# Altium project Master_HV_PCB.PrjPcb (part 1 of 2)
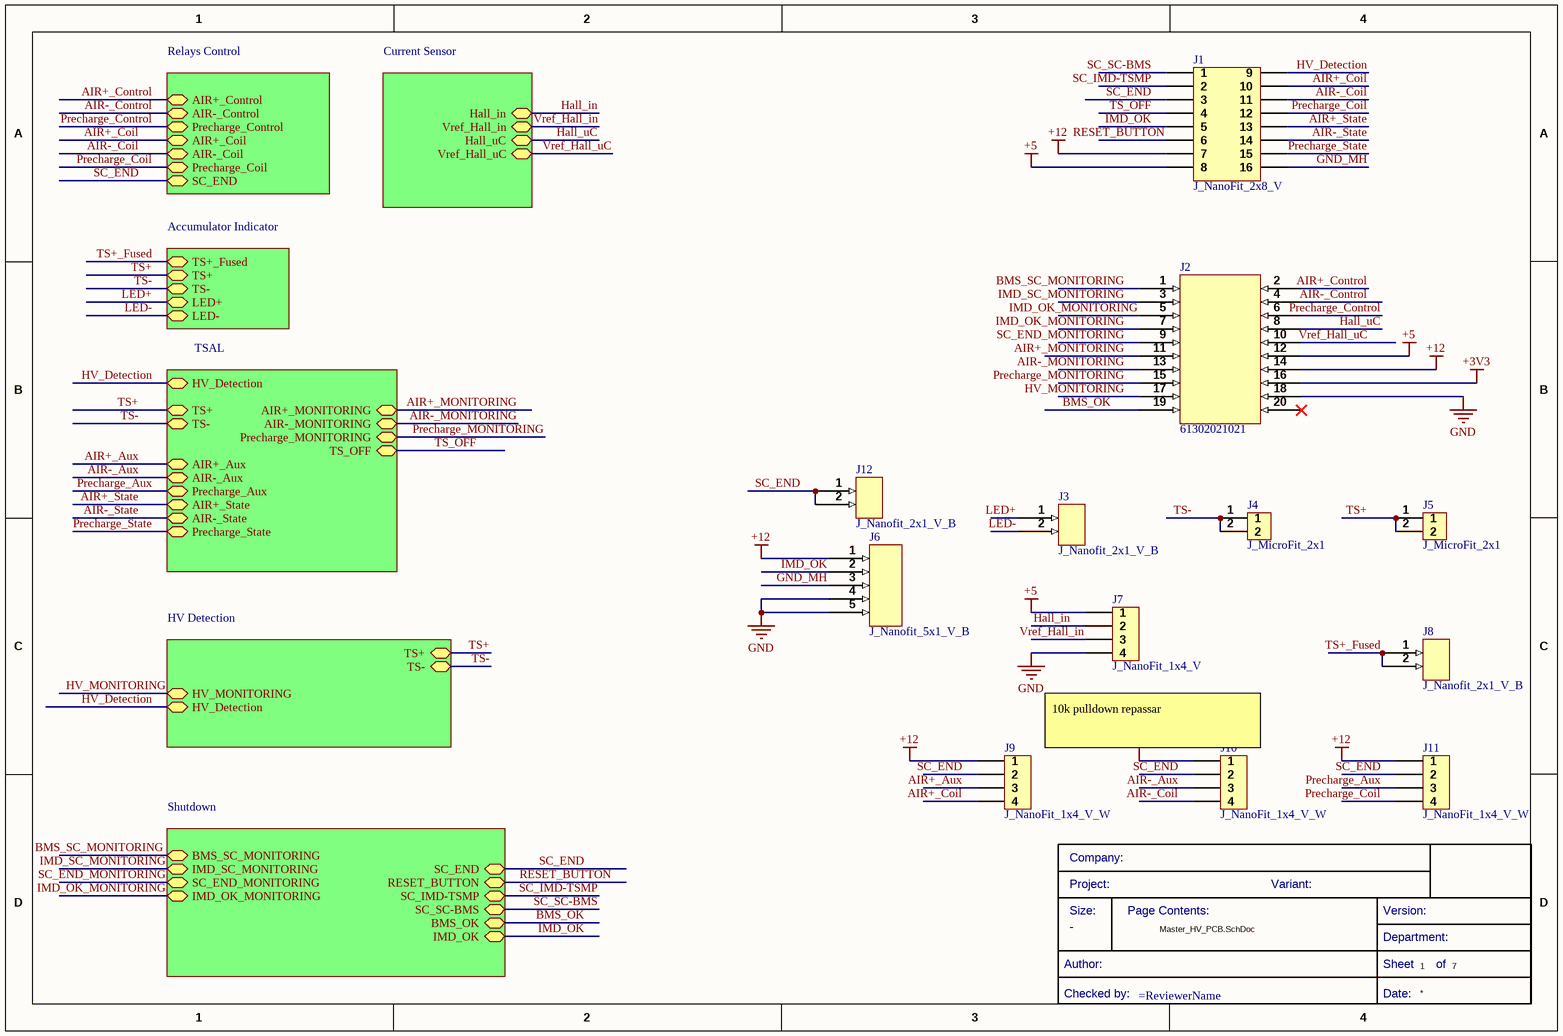
[diagram p0: Master_HV_PCB.SchDoc]
7 sheets, 114 parts. Net scope: hierarchical (ports join the sheet entries above them; power ports are global).
Sheets:
  Master_HV_PCB.SchDoc
    Relays Control = [4]Relays_Control.SchDoc
    Accumulator Indicator = [6]Accumulator_Indicator.SchDoc
    Shutdown = [1]Shutdown.SchDoc
    TSAL = [2]TSAL.SchDoc
    Current Sensor = [5]Current_Sensor.SchDoc
    HV Detection = [3]HV_Detection.SchDoc

## Sheet Master_HV_PCB.SchDoc
size A4; SheetNumber: 1; SheetTotal: 7

### Parts
(Parts that share a designator on the sheet are numbered #1, #2 ... from top to bottom, then left to right.)
?#1  (no value)  (graphical)
J1  J_NanoFit_2x8_V  [J_NanoFit_2x8_V]
J2  61302021021  [61302021021]
J3  J_Nanofit_2x1_V_B  [FP-105309-1102-MFG]
J4  J_MicroFit_2x1  [J_MicroFit_2x1]
J5  J_MicroFit_2x1  [J_MicroFit_2x1]
J6  J_Nanofit_5x1_V_B  [105309-1205-Footprint-1]
J7  J_NanoFit_1x4_V  [J_NanoFit_1x4_V]
J8  J_Nanofit_2x1_V_B  [FP-105309-1102-MFG]
J9  J_NanoFit_1x4_V_W  [J_NanoFit_1x4_V]
J10  J_NanoFit_1x4_V_W  [J_NanoFit_1x4_V]
J11  J_NanoFit_1x4_V_W  [J_NanoFit_1x4_V]
J12  J_Nanofit_2x1_V_B  [FP-105309-1102-MFG]

### Sub-sheets
Accumulator Indicator = [6]Accumulator_Indicator.SchDoc: TS+ (bidir), TS- (bidir), LED+ (bidir), LED- (bidir), TS+_Fused (bidir)
Current Sensor = [5]Current_Sensor.SchDoc: Hall_in (bidir), Vref_Hall_in (bidir), Hall_uC (bidir), Vref_Hall_uC (bidir)
HV Detection = [3]HV_Detection.SchDoc: TS+ (bidir), TS- (bidir), HV_MONITORING (bidir), HV_Detection (bidir)
Relays Control = [4]Relays_Control.SchDoc: AIR+_Control (bidir), AIR-_Control (bidir), Precharge_Control (bidir), AIR+_Coil (bidir), AIR-_Coil (bidir), Precharge_Coil (bidir), SC_END (bidir)
Shutdown = [1]Shutdown.SchDoc: BMS_SC_MONITORING (bidir), IMD_SC_MONITORING (bidir), SC_END_MONITORING (bidir), IMD_OK_MONITORING (bidir), BMS_OK (bidir), IMD_OK (bidir), SC_SC-BMS (bidir), SC_IMD-TSMP (bidir), RESET_BUTTON (bidir), SC_END (bidir)
TSAL = [2]TSAL.SchDoc: TS+ (bidir), TS- (bidir), AIR+_Aux (bidir), AIR-_Aux (bidir), Precharge_Aux (bidir), AIR+_State (bidir), AIR-_State (bidir), Precharge_State (bidir), AIR-_MONITORING (bidir), Precharge_MONITORING (bidir), AIR+_MONITORING (bidir), HV_Detection (bidir), TS_OFF (bidir)

### Nets
+3V3: J2.16
+5: J1.8 J2.12 J7.1
+12: J1.7 J2.14 J6.1 J9.1 J10.1 J11.1
GND: J2.18 J6.4 J6.5 J7.4
AIR+_Aux: J9.3 ; sheet TSAL/AIR+_Aux
AIR+_Coil: J1.10 J9.4 ; sheet Relays Control/AIR+_Coil
AIR+_Control: J2.2 ; sheet Relays Control/AIR+_Control
AIR+_MONITORING: J2.11 ; sheet TSAL/AIR+_MONITORING
AIR+_State: J1.13 ; sheet TSAL/AIR+_State
AIR-_Aux: J10.3 ; sheet TSAL/AIR-_Aux
AIR-_Coil: J1.11 J10.4 ; sheet Relays Control/AIR-_Coil
AIR-_Control: J2.4 ; sheet Relays Control/AIR-_Control
AIR-_MONITORING: J2.13 ; sheet TSAL/AIR-_MONITORING
AIR-_State: J1.14 ; sheet TSAL/AIR-_State
BMS_OK: J2.19 ; sheet Shutdown/BMS_OK
BMS_SC_MONITORING: J2.1 ; sheet Shutdown/BMS_SC_MONITORING
GND_MH: J1.16 J6.3
Hall_in: J7.2 ; sheet Current Sensor/Hall_in
Hall_uC: J2.8 ; sheet Current Sensor/Hall_uC
HV_Detection: J1.9 ; sheet TSAL/HV_Detection, sheet HV Detection/HV_Detection
HV_MONITORING: J2.17 ; sheet HV Detection/HV_MONITORING
IMD_OK: J1.5 J6.2 ; sheet Shutdown/IMD_OK
IMD_OK_MONITORING: J2.5 J2.7 ; sheet Shutdown/IMD_OK_MONITORING
IMD_SC_MONITORING: J2.3 ; sheet Shutdown/IMD_SC_MONITORING
LED+: J3.1 ; sheet Accumulator Indicator/LED+
LED-: J3.2 ; sheet Accumulator Indicator/LED-
Precharge_Aux: J11.3 ; sheet TSAL/Precharge_Aux
Precharge_Coil: J1.12 J11.4 ; sheet Relays Control/Precharge_Coil
Precharge_Control: J2.6 ; sheet Relays Control/Precharge_Control
Precharge_MONITORING: J2.15 ; sheet TSAL/Precharge_MONITORING
Precharge_State: J1.15 ; sheet TSAL/Precharge_State
RESET_BUTTON: J1.6 ; sheet Shutdown/RESET_BUTTON
SC_END: J1.3 J9.2 J10.2 J11.2 J12.1 J12.2 ; sheet Relays Control/SC_END, sheet Shutdown/SC_END
SC_END_MONITORING: J2.9 ; sheet Shutdown/SC_END_MONITORING
SC_IMD-TSMP: J1.2 ; sheet Shutdown/SC_IMD-TSMP
SC_SC-BMS: J1.1 ; sheet Shutdown/SC_SC-BMS
TS+: J5.1 J5.2 ; sheet Accumulator Indicator/TS+, sheet TSAL/TS+, sheet HV Detection/TS+
TS+_Fused: J8.1 J8.2 ; sheet Accumulator Indicator/TS+_Fused
TS-: J4.1 J4.2 ; sheet Accumulator Indicator/TS-, sheet TSAL/TS-, sheet HV Detection/TS-
TS_OFF: J1.4 ; sheet TSAL/TS_OFF
Vref_Hall_in: J7.3 ; sheet Current Sensor/Vref_Hall_in
Vref_Hall_uC: J2.10 ; sheet Current Sensor/Vref_Hall_uC

Not connected (* = marked no-connect by the designer): J2 20*

### Notes on the sheet
- (near J10) 10k pulldown repassar
- Size:
- Company:
- Project:
- Page Contents:
- Variant:
- Version:
- Checked by:
- Author:
- Sheet
- Date:
- Department:
- of

### Library data of the parts
?#1 = CMP-00043-6: Standard Title Block
J1 = CMP-00020-2: Nano-Fit Vertical Header Through Hole 2.50mm Pitch Dual Row 16 Circuits with Kinked Pins Tin (Sn) Plating Black; Manufacturer 1: Molex; Manufacturer Part Number 1: 105310-1116; Connector Type: Header,Male Pin; Number of Positions: 16; .Creator: AC; Fastening Type: Latch; Contact Shape: Square; Mount: Through Hole; Stock 1: 84; ComponentLink2Description: Molex; Source: Electromechanical.SchLib; RoHS: No; Min Operating Temperature: -40°C; Number of Rows: 2; Termination: Kinked Pin; ComponentLink1Description: https://www.molex.com/pdm_docs/sd/1053101210_sd.pdf?src-supplier=Digi-Key; ComponentLink2URL: https://www.molex.com/molex/products/part-detail/pcb_headers/1053101116; Contact Plating: Tin; Insulation Color: Black; Insulation Material: Polymer; Contact Material: Brass; Max Operating Temperature: 105°C; Pricing 1: 1=3,21000, 10=2,82400, 84=2,24619, 1008=1,86110, 4956=1,66858 (USD); Packaging: Tray; ComponentLink1URL: https://www.molex.com/pdm_docs/sd/1053101210_sd.pdf?src-supplier=Digi-Key; Category: Headers and Wire Housings; Design Item ID: J_NanoFit_2x8_V
J2 = CMP-002-00010-1: Board Connector, 20 Contact(s), 2 Row(s), Male, Right Angle, 0.1 inch Pitch, Solder Terminal, Locking, Black Insulator, Plug; Mounting Technology: Board; Connector Type: BOARD CONNECTOR; Max Operating Temperature: 125°C; RoHS Compliant: Yes; Min Operating Temperature: -40°C
J3 J8 J12 = CMP-002-00012-1: Conn HDR 2 POS 2.5mm Solder ST Thru-Hole 2 Terminal 1 Port Nano-Fit Tray
J4 J5 = CMP-00012-1: Header 1 Row Vertical Polarizing Peg 2 Pin SMT/Glow Wire Compatible Tin Plate; Manufacturer 1: Molex; Manufacturer Part Number 1: 43650-0215; ComponentLink6Description: https://datasheet.ciiva.com/7920/1889390-7920892.pdf?src-supplier=Element14; ComponentLink2Description: https://datasheet.ciiva.com/5157/0436500215-pcb-headers-148687-5157608.pdf?src-supplier=Mouser; ComponentLink3Description: https://datasheet.ciiva.com/16085/0436500215-pcb-headers-16085668.pdf?src-supplier=Onlinecomponents.com; ComponentLink3URL: https://datasheet.ciiva.com/16085/0436500215-pcb-headers-16085668.pdf?src-supplier=Onlinecomponents.com; ComponentLink1URL: https://datasheet.ciiva.com/19462/884109-19462034.pdf?src-supplier=Jameco; ComponentLink4Description: https://datasheet.ciiva.com/11748/0900766b80307ce2-11748388.pdf?src-supplier=RSComponents; RoHS: Yes; Design Item ID: J_MicroFit_2x1; ComponentLink6URL: https://datasheet.ciiva.com/7920/1889390-7920892.pdf?src-supplier=Element14; Stock 1: 11086; ComponentLink2URL: https://datasheet.ciiva.com/5157/0436500215-pcb-headers-148687-5157608.pdf?src-supplier=Mouser; ComponentLink1Description: https://datasheet.ciiva.com/19462/884109-19462034.pdf?src-supplier=Jameco; Category: Headers and Wire Housings; ComponentLink5URL: https://datasheet.ciiva.com/9432/0436500215-pcb-headers-9432850.pdf?src-supplier=Avnet; ComponentLink5Description: https://datasheet.ciiva.com/9432/0436500215-pcb-headers-9432850.pdf?src-supplier=Avnet; ComponentLink4URL: https://datasheet.ciiva.com/11748/0900766b80307ce2-11748388.pdf?src-supplier=RSComponents; Pricing 1: 1=0,87800, 10=0,74400, 80=0,63070, 3264=0,47000, 6528=0,45100, 13056=0,41760 (USD); Source: Electromechanical.SchLib
J6 = CMP-002-00013-1: Nano-Fit Vertical Header Through Hole 2.50mm Pitch Single Row 5 Circuits with Kinked Pins 0.38
J7 = CMP-00018-1: Nano-Fit Vertical Header Through Hole 2.50mm Pitch Single Row 4 Circuits with Kinked Pins 0.38; Manufacturer 1: Molex; Manufacturer Part Number 1: 105309-1204; .Creator: DO; Pricing 1: 1=1,37050, 10=1,11700, 100=0,95270, 500=0,86980, 1000=0,74060, 2500=0,71930, 5000=0,68450, 10000=0,66860 (USD); ComponentLink2URL: http://www.farnell.com/datasheets/2221349.pdf?src-supplier=Newark; ComponentLink2Description: http://www.farnell.com/datasheets/2221349.pdf?src-supplier=Newark; ComponentLink4URL: http://www.farnell.com/datasheets/2059602.pdf?src-supplier=Element14; ComponentLink3Description: http://www.literature.molex.com/SQLImages/kelmscott/Molex/PDF_Images/987651-1223.PDF?src-supplier=Digi-Key; ComponentLink1URL: http://farnell.com//datasheets/2221349.pdf?src-supplier=Farnell; Source: Electromechanical.SchLib; ComponentLink3URL: http://www.literature.molex.com/SQLImages/kelmscott/Molex/PDF_Images/987651-1223.PDF?src-supplier=Digi-Key; Category: Headers and Wire Housings; Design Item ID: J_NanoFit_1x4_V; ComponentLink4Description: http://www.farnell.com/datasheets/2059602.pdf?src-supplier=Element14; ComponentLink1Description: http://farnell.com//datasheets/2221349.pdf?src-supplier=Farnell; Stock 1: 709; RoHS: No
J9-J11 = CMP-00027-1: Conn HDR 4 POS 2.5mm Solder ST Thru-Hole 4 Terminal 1 Port Nano-Fit Tray; Manufacturer Part Number 1: 105309-2104; Manufacturer 1: Molex; .Creator: DR; Stock 1: 1183; RoHS: No; Category: Headers and Wire Housings; Source: Electromechanical.SchLib; Design Item ID: J_NanoFit_1x4_V_W; Pricing 1: 1=1,30000, 10=1,15000, 25=1,11000, 50=1,07000, 100=1,02000, 250=0,94400 (USD)

## Sheet [4]Relays_Control.SchDoc
size A4; SheetNumber: 5; SheetTotal: 7
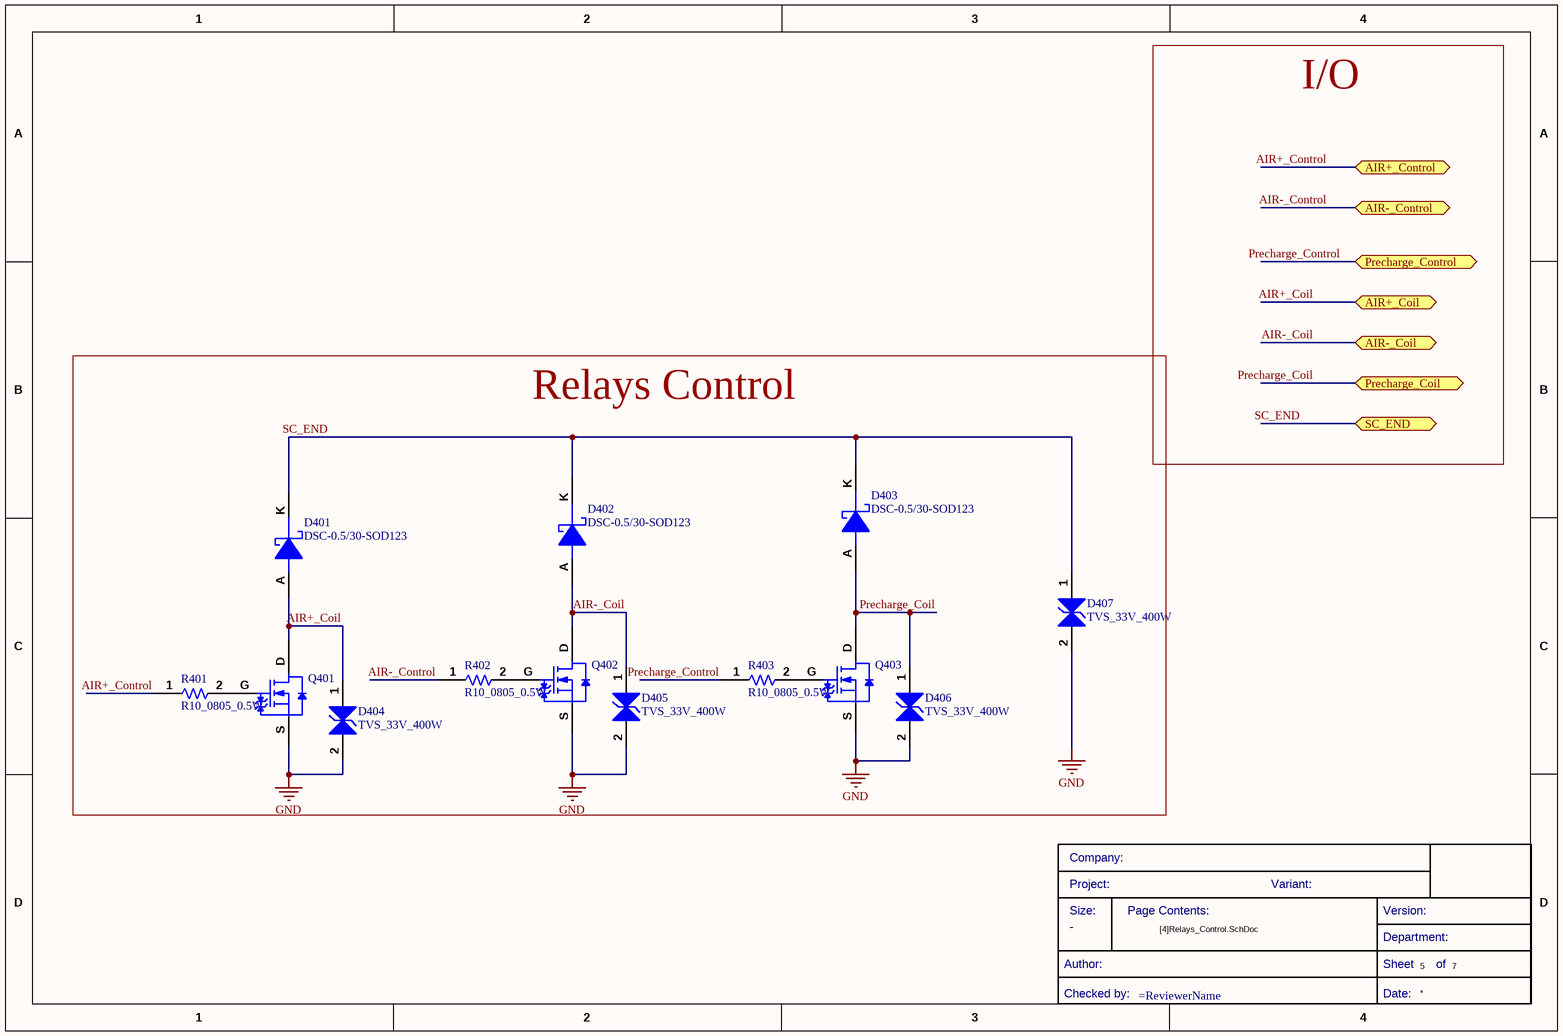
[diagram p1: [4]Relays_Control.SchDoc]

### Parts
(Parts that share a designator on the sheet are numbered #1, #2 ... from top to bottom, then left to right.)
?#2  (no value)  (graphical)
D401  DSC-0.5/30-SOD123  [DSC-SOD123]
D402  DSC-0.5/30-SOD123  [DSC-SOD123]
D403  DSC-0.5/30-SOD123  [DSC-SOD123]
D404  TVS_33V_400W  [WE-TVSP_DO-214AC_Bidirectional]
D405  TVS_33V_400W  [WE-TVSP_DO-214AC_Bidirectional]
D406  TVS_33V_400W  [WE-TVSP_DO-214AC_Bidirectional]
D407  TVS_33V_400W  [WE-TVSP_DO-214AC_Bidirectional]
Q401  SQ2318CES-T1_GE3  [SOT95P245X110-3N]  (value not drawn)
Q402  SQ2318CES-T1_GE3  [SOT95P245X110-3N]  (value not drawn)
Q403  SQ2318CES-T1_GE3  [SOT95P245X110-3N]  (value not drawn)
R401  R10_0805_0.5W  [0805]
R402  R10_0805_0.5W  [0805]
R403  R10_0805_0.5W  [0805]

### Blocks framed on the sheet
Relays Control: D401-D407 Q401-Q403 R401-R403

### Ports
AIR+_Coil (bidir, see Master_HV_PCB[1A]), AIR+_Control (bidir, see Master_HV_PCB[1A]), AIR-_Coil (bidir, see Master_HV_PCB[1A]), AIR-_Control (bidir, see Master_HV_PCB[1A]), Precharge_Coil (bidir, see Master_HV_PCB[1A]), Precharge_Control (bidir, see Master_HV_PCB[1A]), SC_END (bidir, see Master_HV_PCB[1A], [1]Shutdown[1A])

### Nets
GND: D404.2 D405.2 D406.2 D407.2 Q401.S Q402.S Q403.S
AIR+_Coil: D401.A D404.1 Q401.D ; port AIR+_Coil
AIR+_Control: R401.1 ; port AIR+_Control
AIR-_Coil: D402.A D405.1 Q402.D ; port AIR-_Coil
AIR-_Control: R402.1 ; port AIR-_Control
Precharge_Coil: D403.A D406.1 Q403.D ; port Precharge_Coil
Precharge_Control: R403.1 ; port Precharge_Control
SC_END: D401.K D402.K D403.K D407.1 ; port SC_END
NetQ401_G: Q401.G R401.2
NetQ402_G: Q402.G R402.2
NetQ403_G: Q403.G R403.2

### Notes on the sheet
- I/O
- Size:
- Company:
- Project:
- Page Contents:
- Variant:
- Version:
- Checked by:
- Author:
- Sheet
- Date:
- Department:
- of

### Library data of the parts
?#2 = CMP-00043-6: Standard Title Block
D401-D403 = CMP-00165-1: VR=30V IF=500mA 30pF P=410mW; Max Reverse Leakage Current: 130uA; .Creator: GP; Max Reverse Voltage (DC): 30V; Element Configuration: Single; Average Rectified Current: 500mA; Peak Non-Repetitive Surge Current: 5.5A; Polarity: Standard; Forward Voltage: 430mV; ComponentLink10Description: https://datasheet.ciiva.com/910/mbr0530-910518.pdf?src-supplier=Digi-Key; ComponentLink1Description: Datasheet; Category: Diode; ComponentLink3Description: https://datasheet.ciiva.com/30479/0900766b810e2512-30479401.pdf?src-supplier=RSComponents; ComponentLink5Description: https://datasheet.ciiva.com/910/mbr0530-910516.pdf?src-supplier=Digi-Key; Stock 1: 9; Weight: 0.03g; Source: Filter components.SchLib; ComponentLink2Description: Where buy it; Series: -; Mount: Surface Mount; Max Repetitive Reverse Voltage (Vrrm): 30V; Pricing 1: 1=0,34400, 10=0,23900, 100=0,12200, 500=0,10000 (USD); Design Item ID: DSC-0.5/30-SOD123; ComponentLink8Description: https://datasheet.ciiva.com/17318/mbr0530-17318568.pdf?src-supplier=Future+Electronics; Current Rating: 500mA; ComponentLink1URL: *; Length: 2.7mm; Max Reverse Current: 130uA; ComponentLink7URL: https://datasheet.ciiva.com/8300/mbr0530-8300905.pdf?src-supplier=Avnet; ComponentLink9URL: https://datasheet.ciiva.com/15144/getdatasheetpartid-86760-15144598.pdf?src-supplier=Verical; Radiation Hardening: No; Height: 1.03mm; ComponentLink4Description: https://datasheet.ciiva.com/34301/974753-34301826.pdf?src-supplier=Jameco; ComponentLink7Description: https://datasheet.ciiva.com/8300/mbr0530-8300905.pdf?src-supplier=Avnet; Package Quantity: 1; Forward Current: 500mA; ComponentLink5URL: https://datasheet.ciiva.com/910/mbr0530-910516.pdf?src-supplier=Digi-Key; Max Surge Current: 5.5A; Lead Free: Lead Free; ComponentLink2URL: *; Max Forward Surge Current (Ifsm): 5.5A; Output Current: 500mA; Voltage Rating (DC): 30V; Contact Plating: Tin,Matte; RoHS Compliant: Yes; REACH SVHC: No SVHC; ComponentLink10URL: https://datasheet.ciiva.com/910/mbr0530-910518.pdf?src-supplier=Digi-Key; ComponentLink4URL: https://datasheet.ciiva.com/34301/974753-34301826.pdf?src-supplier=Jameco; ComponentLink6URL: https://datasheet.ciiva.com/25931/mbr0530-25931989.pdf?src-supplier=Avnet+Europe; ComponentLink6Description: https://datasheet.ciiva.com/25931/mbr0530-25931989.pdf?src-supplier=Avnet+Europe; Width: 1.6mm; ComponentLink3URL: https://datasheet.ciiva.com/30479/0900766b810e2512-30479401.pdf?src-supplier=RSComponents; ComponentLink9Description: https://datasheet.ciiva.com/15144/getdatasheetpartid-86760-15144598.pdf?src-supplier=Verical; ComponentLink8URL: https://datasheet.ciiva.com/17318/mbr0530-17318568.pdf?src-supplier=Future+Electronics
D404-D407 = CMP-004-00003-1: Trans Voltage Suppressor Diode, 400W, Bidirectional, 1 Element, Silicon, DO-214AC; Min Operating Temperature: -65°C; Pins: 2; RoHS Compliant: Yes; Max Operating Temperature: 150°C
Q401-Q403 = CMP-013-00002-1: Mosfet, N-channel, 40V, 7A, SOT-23 Rohs Compliant: Yes
R401-R403 = CMP-009-00031-1: Fixed Resistor, Metal Glaze/thick Film, 0.5W, 10ohm, 150V, 1% +/-Tol, 100ppm/Cel, Surface Mount, 0805; Power: 500mW; Value: 10; Tolerance: 1%; Max Operating Temperature: 155°C; RoHS Compliant: Yes; Case/Package: 0805; Min Operating Temperature: -55°C; Mounting Technology: Surface Mount; Pins: 2

## Sheet [6]Accumulator_Indicator.SchDoc
size A4; SheetNumber: 2; SheetTotal: 7
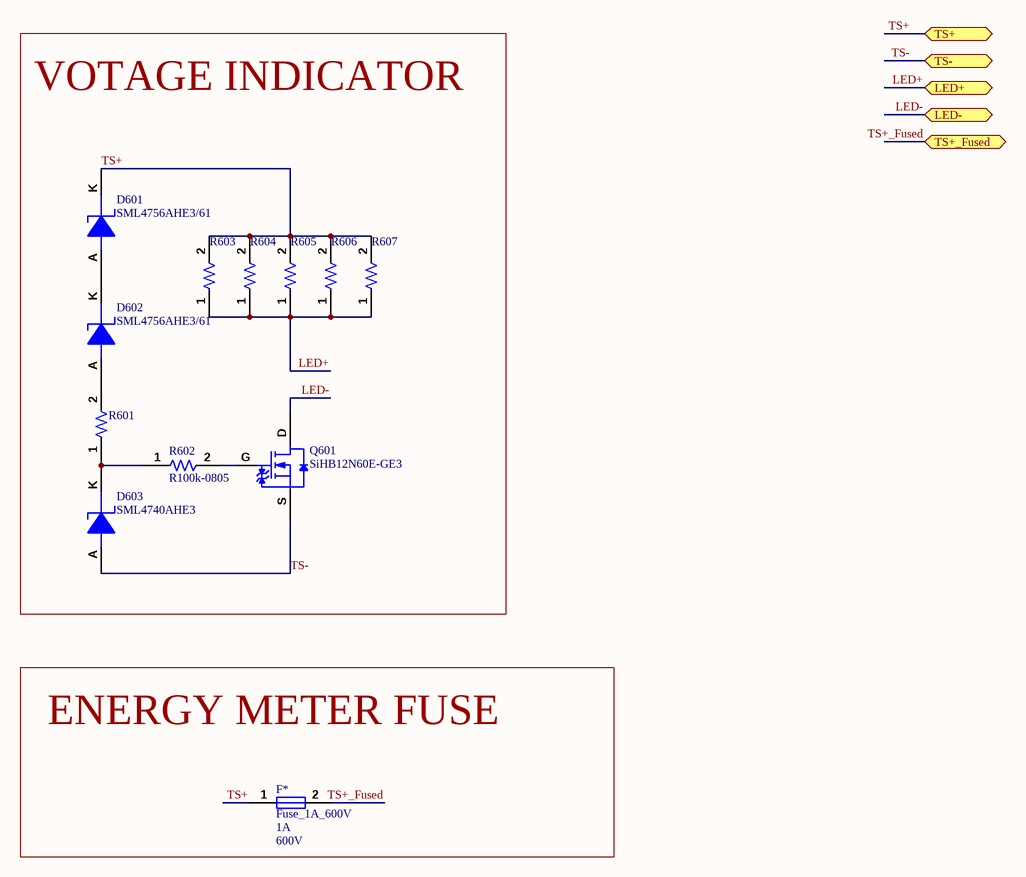
[diagram p2: [6]Accumulator_Indicator.SchDoc]

### Parts
(Parts that share a designator on the sheet are numbered #1, #2 ... from top to bottom, then left to right.)
?#3  (no value)  (graphical)
D601  SML4756AHE3/61  [DIOM4227X23N]
D602  SML4756AHE3/61  [DIOM4227X23N]
D603  SML4740AHE3  [DIOM4227X23N]
F*  Fuse_1A_600V  Current Rating: 1A  Voltage Rating (DC): 600V  [Fuse_485001]
Q601  SiHB12N60E-GE3  [SiHB12N60E-GE3-Footprint-1]
R601  PR03000201003JAC00  [PR03000202203JDC00-Footprint-1]  (value not drawn)
R602  R100k-0805  [RESC2013X70X40NL20T20]
R603  PR03000202203JDC00  [PR03000202203JDC00-Footprint-1]  (value not drawn)
R604  PR03000202203JDC00  [PR03000202203JDC00-Footprint-1]  (value not drawn)
R605  PR03000202203JDC00  [PR03000202203JDC00-Footprint-1]  (value not drawn)
R606  PR03000202203JDC00  [PR03000202203JDC00-Footprint-1]  (value not drawn)
R607  PR03000202203JDC00  [PR03000202203JDC00-Footprint-1]  (value not drawn)

### Blocks framed on the sheet
VOTAGE INDICATOR: D601-D603 Q601 R601-R607
ENERGY METER FUSE: F*

### Ports
LED+ (bidir, see Master_HV_PCB[1B]), LED- (bidir, see Master_HV_PCB[1B]), TS+ (bidir, see Master_HV_PCB[1B], [2]TSAL[4C], [3]HV_Detection[4B]), TS+_Fused (bidir, see Master_HV_PCB[1B]), TS- (bidir, see Master_HV_PCB[1B], [2]TSAL[4C], [3]HV_Detection[4B])

### Nets
LED+: R603.1 R604.1 R605.1 R606.1 R607.1 ; port LED+
LED-: Q601.D ; port LED-
TS+: D601.K F*.1 R603.2 R604.2 R605.2 R606.2 R607.2 ; port TS+
TS+_Fused: F*.2 ; port TS+_Fused
TS-: D603.A Q601.S ; port TS-
NetD601_A: D601.A D602.K
NetD602_A: D602.A R601.2
NetD603_K: D603.K R601.1 R602.1
NetQ601_G: Q601.G R602.2

### Notes on the sheet
- Size:
- Company:
- Project:
- Page Contents:
- Variant:
- Version:
- Checked by:
- Author:
- Sheet
- Date:
- Department:
- of

### Library data of the parts
?#3 = CMP-00043-6: Standard Title Block
D601 D602 = CMP-004-00000-1: Zener Diode, 47V V(Z), 5%, 1W, Silicon, Unidirectional, DO-214AC; Pins: 2; Max Operating Temperature: 150°C; RoHS Compliant: Yes
D603 = CMP-00196-1: Zener Diode, 10V V(Z), 5%, 1W, Silicon, Unidirectional, DO-214AC; Reference Standard: AEC-Q101; Time @ Peak Reflow Temperature-Max (s): 10s; Package Body Material: Plastic; Number of Elements: 1; Test Current: 25mA; Dynamic Impedance-Max: 7R; JESD-30 Code: R-PDSO-C2; Terminal Finish: Tin; Moisture Sensitivity Level: 1; RoHS Compliant: Yes; Technology: ZENER; Surface Mount: Yes; Max Power Dissipation: 1W; Pins: 2; JESD-609 Code: e3; Voltage Tol-Max: 5%; Diode Type: ZENER; Package Shape: Rectangular; Peak Reflow Temperature (Cel): 260°C; Terminal Form: C BEND; Reach SVHC Compliant: Yes; Reference Voltage-Nom: 10V; Max Operating Temperature: 150°C; JEDEC-95 Code: DO-214AC; Terminal Position: DUAL; Package Style: SMALL OUTLINEMeter; Diode Element Material: SILICON; Polarity: Unidirectional
F* = CMP-00161-1: Surface Mount Fuses 600V 1A Fast Acting; Manufacturer Part Number 1: 0485001.DR; Manufacturer 1: Littelfuse; .Creator: DO; Voltage Rating (AC): 250V; Approvals: UL,CSA; Fuse Type: Board Mount (Cartridge Style Excluded); Resistance: 0.264; DC Cold Resistance: 304.4mR; Body Material: Ceramic; Max Operating Temperature: 125°C; Pricing 1: 1=2,82900, 5=2,81400, 10=2,75200, 50=2,59800, 100=2,40300, 250=2,37900, 500=2,30400, 1500=2,24900, 3000=2,11600 (USD); Min Operating Temperature: -55°C; ComponentLink5Description: http://www.littelfuse.com/~/media/Files/Littelfuse/Technical%20Resources/Documents/Data%20Sheets/Littelfuse_Fuse_485_Datasheet.pdf?src-supplier=Element14; Length: 12.1mm; Case/Package: SMD/SMT; Housing Material: Ceramic; REACH SVHC: No SVHC; Category: Fuses; Mount: Surface Mount; Lead Free: Lead Free; Voltage Rating: 600V; ComponentLink1URL: http://www.farnell.com/datasheets/1945989.pdf?src-supplier=Farnell; RoHS Compliant: Yes; Height: 0.177inch; Stock 1: 4123; Series: 485; ComponentLink6Description: http://www.littelfuse.com/~/media/electronics/datasheets/fuses/littelfuse_fuse_485_datasheet.pdf.pdf?src-supplier=Digi-Key; ComponentLink4Description: http://components.arrow.com/part/dataview/56707787S790276N3675?src-supplier=Arrow+Electronics; ComponentLink5URL: http://www.littelfuse.com/~/media/Files/Littelfuse/Technical%20Resources/Documents/Data%20Sheets/Littelfuse_Fuse_485_Datasheet.pdf?src-supplier=Element14; ComponentLink1Description: http://www.farnell.com/datasheets/1945989.pdf?src-supplier=Farnell; ComponentLink2URL: http://www.farnell.com/datasheets/2282568.pdf?src-supplier=Farnell; Termination: SMD/SMT; ComponentLink3URL: http://www.mouser.com/ds/2/240/Littelfuse485_datasheet_080512-201879.pdf?src-supplier=Mouser; Source: Filter components.SchLib; Depth: 4.5mm; Package Quantity: 1; ComponentLink3Description: http://www.mouser.com/ds/2/240/Littelfuse485_datasheet_080512-201879.pdf?src-supplier=Mouser; ComponentLink6URL: http://www.littelfuse.com/~/media/electronics/datasheets/fuses/littelfuse_fuse_485_datasheet.pdf.pdf?src-supplier=Digi-Key; RoHS: Yes; Design Item ID: Fuse_1A_600V; Fuse Current: 1A; Width: 0.177inch; ComponentLink2Description: http://www.farnell.com/datasheets/2282568.pdf?src-supplier=Farnell; Packaging: Tape and Reel; ComponentLink4URL: http://components.arrow.com/part/dataview/56707787S790276N3675?src-supplier=Arrow+Electronics
Q601 = CMP-013-00000-1: Power Field-Effect Transistor, 12A I(D), 600V, 0.38ohm, 1-Element, N-Channel, Silicon, Metal-oxide Semiconductor FET, TO-263AB; Max Operating Temperature: 150°C; RoHS Compliant: Yes; Pins: 2
R601 = CMP-009-00007-2: Fixed Resistor, Metal Film, 3W, 100000ohm, 750V, 5% +/-Tol, 250ppm/Cel, Through Hole Mount; Value: 100k; Pins: 2; Tolerance: 5%; Min Operating Temperature: -55°C; Power: 3W; Max Operating Temperature: 155°C; Mounting Technology: Through Hole; RoHS Compliant: Yes
R602 = CMP-009-00003-2: Fixed Resistor, Metal Glaze/thick Film, 0.125W, 100000ohm, 150V, 5% +/-Tol, 200ppm/Cel, Surface Mount, 0805; Value: 100k; Power: 125mW; Max Operating Temperature: 155°C; Mounting Technology: Surface Mount; RoHS Compliant: Yes; Min Operating Temperature: -55°C; Pins: 2; Case/Package: 0805; Tolerance: 5%
R603-R607 = CMP-009-00006-1: Fixed Resistor, Metal Film, 3W, 220000ohm, 750V, 5% +/-Tol, 250ppm/Cel, Through Hole Mount; RoHS Compliant: Yes

## Sheet [1]Shutdown.SchDoc
size A4; SheetNumber: 3; SheetTotal: 6
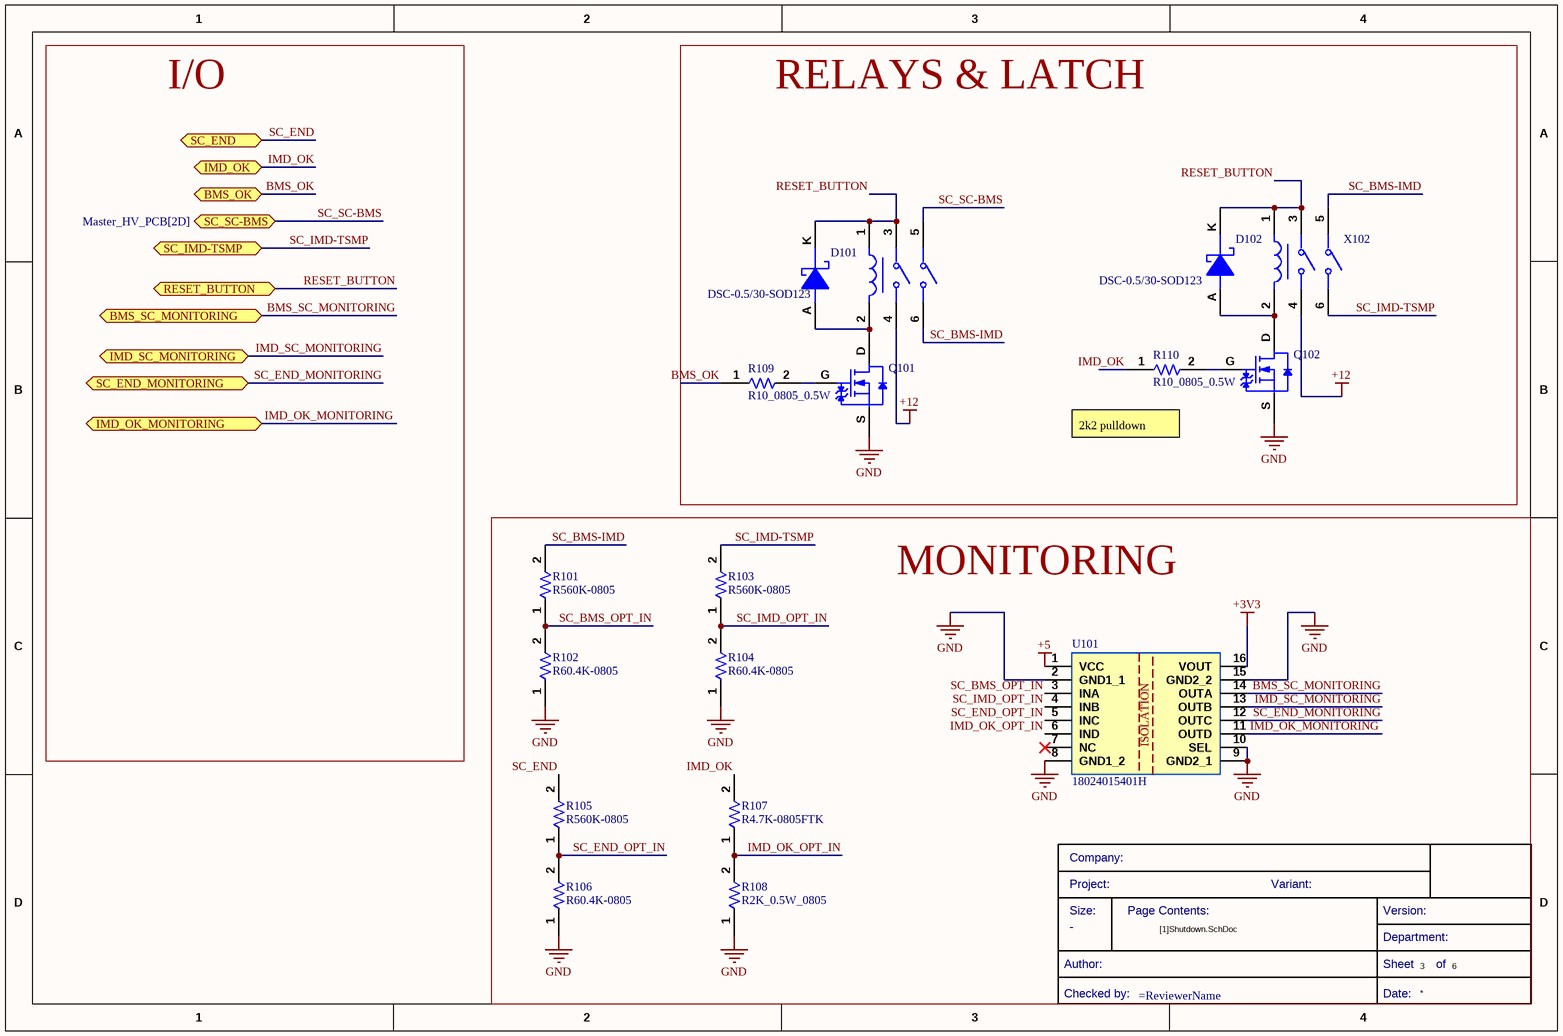
[diagram p3: [1]Shutdown.SchDoc]

### Parts
(Parts that share a designator on the sheet are numbered #1, #2 ... from top to bottom, then left to right.)
?#4  (no value)  (graphical)
D101  DSC-0.5/30-SOD123  [DSC-SOD123]
D102  DSC-0.5/30-SOD123  [DSC-SOD123]
Q101  SQ2318CES-T1_GE3  [SOT95P245X110-3N]  (value not drawn)
Q102  SQ2318CES-T1_GE3  [SOT95P245X110-3N]  (value not drawn)
R101  R560K-0805  [0805]
R102  R60.4K-0805  [FP-CR0805-IPC_A]
R103  R560K-0805  [0805]
R104  R60.4K-0805  [FP-CR0805-IPC_A]
R105  R560K-0805  [0805]
R106  R60.4K-0805  [FP-CR0805-IPC_A]
R107  R4.7K-0805FTK  [R0805FTK]
R108  R2K_0.5W_0805  [0805]
R109  R10_0805_0.5W  [0805]
R110  R10_0805_0.5W  [0805]
U101  18024015401H  [18024015401H]
X101  RTE44012F  [RTE44012F-Footprint-1]  (value not drawn)
X102  RTE44012F  [RTE44012F-Footprint-1]  (value not drawn)

### Blocks framed on the sheet
RELAYS & LATCH: D101 D102 Q101 Q102 R109 R110 X101 X102
MONITORING: ?#4 R101-R108 U101

### Ports
BMS_OK (bidir, see Master_HV_PCB[2D]), BMS_SC_MONITORING (bidir, see Master_HV_PCB[1D]), IMD_OK (bidir, see Master_HV_PCB[2D]), IMD_OK_MONITORING (bidir, see Master_HV_PCB[1D]), IMD_SC_MONITORING (bidir, see Master_HV_PCB[1D]), RESET_BUTTON (bidir, see Master_HV_PCB[2D]), SC_END (bidir, see Master_HV_PCB[2D], [4]Relays_Control[4B]), SC_END_MONITORING (bidir, see Master_HV_PCB[1D]), SC_IMD-TSMP (bidir, see Master_HV_PCB[2D]), SC_SC-BMS (bidir, see Master_HV_PCB[2D])

### Nets
+3V3: U101.16(VOUT)
+5: U101.1(VCC)
+12: X101.4 X102.4
GND: Q101.S Q102.S R102.1 R104.1 R106.1 R108.1 U101.2(GND1_1) U101.8(GND1_2) U101.9(GND2_1) U101.10(SEL) U101.15(GND2_2)
BMS_OK: R109.1 ; port BMS_OK
BMS_SC_MONITORING: U101.14(OUTA) ; port BMS_SC_MONITORING
IMD_OK: R107.2 R110.1 ; port IMD_OK
IMD_OK_MONITORING: U101.11(OUTD) ; port IMD_OK_MONITORING
IMD_OK_OPT_IN: R107.1 R108.2 U101.6(IND)
IMD_SC_MONITORING: U101.13(OUTB) ; port IMD_SC_MONITORING
RESET_BUTTON: D101.K D102.K X101.1 X101.3 X102.1 X102.3 ; port RESET_BUTTON
SC_BMS-IMD: R101.2 X101.6 X102.5
SC_BMS_OPT_IN: R101.1 R102.2 U101.3(INA)
SC_END: R105.2 ; port SC_END
SC_END_MONITORING: U101.12(OUTC) ; port SC_END_MONITORING
SC_END_OPT_IN: R105.1 R106.2 U101.5(INC)
SC_IMD-TSMP: R103.2 X102.6 ; port SC_IMD-TSMP
SC_IMD_OPT_IN: R103.1 R104.2 U101.4(INB)
SC_SC-BMS: X101.5 ; port SC_SC-BMS
NetD101_A: D101.A Q101.D X101.2
NetD102_A: D102.A Q102.D X102.2
NetQ101_G: Q101.G R109.2
NetQ102_G: Q102.G R110.2

Not connected (* = marked no-connect by the designer): U101 7(NC)*

### Notes on the sheet
- I/O
- (near R110) 2k2 pulldown
- Size:
- Company:
- Project:
- Page Contents:
- Variant:
- Version:
- Checked by:
- Author:
- Sheet
- Date:
- Department:
- of
- (in symbol CMP-00200-1) ISOLATION

### Library data of the parts
?#4 = CMP-00043-6: Standard Title Block
D101 D102 = CMP-00165-1: as D401 on sheet [4]Relays_Control; ComponentLink10Description: https://datasheet.ciiva.com/910/mbr0530-910518.pdf?src-supplier=Digi-Key; ComponentLink1Description: Datasheet; Category: Diode; ComponentLink3Description: https://datasheet.ciiva.com/30479/0900766b810e2512-30479401.pdf?src-supplier=RSComponents; ComponentLink5Description: https://datasheet.ciiva.com/910/mbr0530-910516.pdf?src-supplier=Digi-Key; Stock 1: 9; Weight: 0.03g; Source: Filter components.SchLib; ComponentLink2Description: Where buy it; Series: -; Mount: Surface Mount; Max Repetitive Reverse Voltage (Vrrm): 30V; Pricing 1: 1=0,34400, 10=0,23900, 100=0,12200, 500=0,10000 (USD); Design Item ID: DSC-0.5/30-SOD123; ComponentLink8Description: https://datasheet.ciiva.com/17318/mbr0530-17318568.pdf?src-supplier=Future+Electronics; Current Rating: 500mA; ComponentLink1URL: *; Length: 2.7mm; Max Reverse Current: 130uA; ComponentLink7URL: https://datasheet.ciiva.com/8300/mbr0530-8300905.pdf?src-supplier=Avnet; ComponentLink9URL: https://datasheet.ciiva.com/15144/getdatasheetpartid-86760-15144598.pdf?src-supplier=Verical; Radiation Hardening: No; Height: 1.03mm; ComponentLink4Description: https://datasheet.ciiva.com/34301/974753-34301826.pdf?src-supplier=Jameco; ComponentLink7Description: https://datasheet.ciiva.com/8300/mbr0530-8300905.pdf?src-supplier=Avnet; Package Quantity: 1; Forward Current: 500mA; ComponentLink5URL: https://datasheet.ciiva.com/910/mbr0530-910516.pdf?src-supplier=Digi-Key; Max Surge Current: 5.5A; Lead Free: Lead Free; ComponentLink2URL: *; Max Forward Surge Current (Ifsm): 5.5A; Output Current: 500mA; Voltage Rating (DC): 30V; Contact Plating: Tin,Matte; RoHS Compliant: Yes; REACH SVHC: No SVHC; ComponentLink10URL: https://datasheet.ciiva.com/910/mbr0530-910518.pdf?src-supplier=Digi-Key; ComponentLink4URL: https://datasheet.ciiva.com/34301/974753-34301826.pdf?src-supplier=Jameco; ComponentLink6URL: https://datasheet.ciiva.com/25931/mbr0530-25931989.pdf?src-supplier=Avnet+Europe; ComponentLink6Description: https://datasheet.ciiva.com/25931/mbr0530-25931989.pdf?src-supplier=Avnet+Europe; Width: 1.6mm; ComponentLink3URL: https://datasheet.ciiva.com/30479/0900766b810e2512-30479401.pdf?src-supplier=RSComponents; ComponentLink9Description: https://datasheet.ciiva.com/15144/getdatasheetpartid-86760-15144598.pdf?src-supplier=Verical; ComponentLink8URL: https://datasheet.ciiva.com/17318/mbr0530-17318568.pdf?src-supplier=Future+Electronics
Q101 Q102 = CMP-013-00002-1: as Q401 on sheet [4]Relays_Control
R101 R103 R105 = CMP-009-00008-2: Fixed Resistor, Metal Glaze/thick Film, 0.125W, 560000ohm, 150V, 1% +/-Tol, 100ppm/Cel, Surface Mount, 0805; Power: 125mW; Value: 560k; Min Operating Temperature: -55°C; Case/Package: 0805; RoHS Compliant: Yes; Tolerance: 1%; Mounting Technology: Surface Mount; Pins: 2; Max Operating Temperature: 155°C
R102 R104 R106 = CMP-009-00001-1: Fixed Resistor, Metal Glaze/thick Film, 0.125W, 60400ohm, 150V, 1% +/-Tol, 100ppm/Cel, Surface Mount, 0805; Value: 60.4k; Power: 125mW; RoHS Compliant: Yes; Mounting Technology: Surface Mount; Tolerance: 1%; Max Operating Temperature: 155°C; Case/Package: 0805; Min Operating Temperature: -55°C; Pins: 2
R107 = CMP-00102-1: Res Thick Film 0805 4.7K Ohm 5% 1/8W ±200ppm/°C Molded SMD SMD Paper Tape on Plastic Reel; Manufacturer Part Number 1: CR0805-JW-472ELF; Manufacturer 1: Bourns; Max Power Dissipation: 125mW; .Creator: DR; Voltage Rating (DC): 150V; ComponentLink5URL: https://datasheet.ciiva.com/9122/chpreztr-9122814.pdf?src-supplier=Avnet; ComponentLink2URL: https://datasheet.ciiva.com/6560/chpreztr-6560073.pdf?src-supplier=Digi-Key; Depth: 1.25mm; ComponentLink7URL: https://datasheet.ciiva.com/6560/chpreztr-6560075.pdf?src-supplier=Digi-Key; Radiation Hardening: No; ComponentLink5Description: https://datasheet.ciiva.com/9122/chpreztr-9122814.pdf?src-supplier=Avnet; Construction: Rectangular; Case/Package: 0805; Design Item ID: R4.7K-0805FTK; RoHS Compliant: Yes; Min Operating Temperature: -55°C; Height: 0.024inch; ComponentLink1Description: https://datasheet.ciiva.com/5541/chpreztr-5541593.pdf?src-supplier=Mouser; Series: CR0805; Packaging: Tape and Reel; Width: 0.049inch; Stock 1: 3734; ComponentLink3URL: https://datasheet.ciiva.com/6560/chpreztr-6560074.pdf?src-supplier=Digi-Key; ComponentLink4URL: https://datasheet.ciiva.com/30174/159chpreztr-30174252.pdf?src-supplier=Onlinecomponents.com; Value: 4.7k; Military Standard: Not; Tolerance: 5%; Voltage Rating: 150V; ComponentLink6Description: https://datasheet.ciiva.com/22713/691949-22713272.pdf?src-supplier=Element14; REACH SVHC: No SVHC; Package Quantity: 1; Termination: SMD/SMT; ComponentLink1URL: https://datasheet.ciiva.com/5541/chpreztr-5541593.pdf?src-supplier=Mouser; ComponentLink4Description: https://datasheet.ciiva.com/30174/159chpreztr-30174252.pdf?src-supplier=Onlinecomponents.com; Resistor Type: Thick Film; Length: 2mm; Case Code (Metric): 2012; Category: Chip SMD Resistors; Resistance Tolerance: 5%; Thickness: 508um; ComponentLink6URL: https://datasheet.ciiva.com/22713/691949-22713272.pdf?src-supplier=Element14; Features: Moisture Resistant; Power Rating: 125mW; RoHS: Yes; Mount: Surface Mount; ComponentLink7Description: https://datasheet.ciiva.com/6560/chpreztr-6560075.pdf?src-supplier=Digi-Key; Number of Terminations: 2; Source: Passives.SchLib; Temperature Coefficient: 200ppm/°C; Max Operating Temperature: 155°C; ComponentLink3Description: https://datasheet.ciiva.com/6560/chpreztr-6560074.pdf?src-supplier=Digi-Key; ComponentLink2Description: https://datasheet.ciiva.com/6560/chpreztr-6560073.pdf?src-supplier=Digi-Key; Pricing 1: 1=0,05590, 10=0,01670, 25=0,01290, 100=0,00840, 250=0,00830, 500=0,00690, 1000=0,00410 (USD); Contact Plating: Tin
R108 = CMP-009-00027-1: Fixed Resistor, Metal Glaze/thick Film, 0.5W, 2000ohm, 150V, 1% +/-Tol, 100ppm/Cel, Surface Mount, 0805; Part Number: CRCW08052K00FKEAHP; Manufacturer: Vishay; Value: 2k; Power: 500mW; Max Operating Temperature: 155°C; Case/Package: 0805; Mounting Technology: Surface Mount; RoHS Compliant: Yes; Tolerance: 1%; Min Operating Temperature: -55°C; Pins: 2
R109 R110 = CMP-009-00031-1: as R401 on sheet [4]Relays_Control; Tolerance: 1%; Max Operating Temperature: 155°C; RoHS Compliant: Yes; Case/Package: 0805; Min Operating Temperature: -55°C; Mounting Technology: Surface Mount; Pins: 2
U101 = CMP-00200-1: Digital Isolator, 4CH, 125DEG C, WSOIC16 Rohs Compliant: Yes
X101 X102 = CMP-00199-1: Power/Signal Relay, 2 Form A, DPST, Momentary, 0.033A (Coil), 12VDC (Coil), 400mW (Coil), 8A (Contact), 30VDC (Contact), DC Input, Random, AC/DC Output, Through Hole-Straight Mount; Sealing: IMMERSION CLEANABLE CASE; Electrical Life: 30000Cycles; Release Time: 6ms; Operate Time: 15ms; Body Length or Diameter: 29mm; Contact AC Max Power Rating R Load: 2000VA@400VAC; Coil Voltage-Nom: 12V; Body Height: 15.7mm; Dielectric Strength Between Open Contacts: 1000Vrms; PCB Hole Count: 8; Reference Standard: UL; Coil Current(DC)-Max: 33mA; Contact Voltage(AC)-Max: 250V; Dielectric Strength Between Coil and Contacts: 5000Vrms; Coil Resistance: 360R; Coil Operate Voltage(DC): 8.4V; Body Breadth: 12.7inch; Contact DC Max Rating R Load: 8A@30VDC; Contact Voltage(DC)-Max: 30V; Contact AC Max Rating R Load: 8A@250VAC; Coil Release Voltage(DC): 1.2V; End Contact Material: Silver; Relay Form: 2 FORM A; Input Switching Control Type: Random; Min Operating Temperature: -40°C; Termination: Solder; Contact/Output Supply Type: AC/DC; Max Operating Temperature: 85°C; Mounting Technology: Through Hole; Contact Current(AC)-Max: 8A; Coil Power: 400mW; Terminal Length: 0.0036inch; Weight: 13g; Coil/Input Supply Type: DC; RoHS Compliant: Yes; Pins: 8; Relay Function: DPST; Packaging: Box; Contact Current(DC)-Max: 8A; Relay Action: MOMENTARY; Coil Voltage(DC)-Max: 12V; Relay Type: POWER/SIGNAL RELAY; Reach SVHC Compliant: Yes

## Sheet [2]TSAL.SchDoc
size A4; SheetNumber: 4; SheetTotal: 7
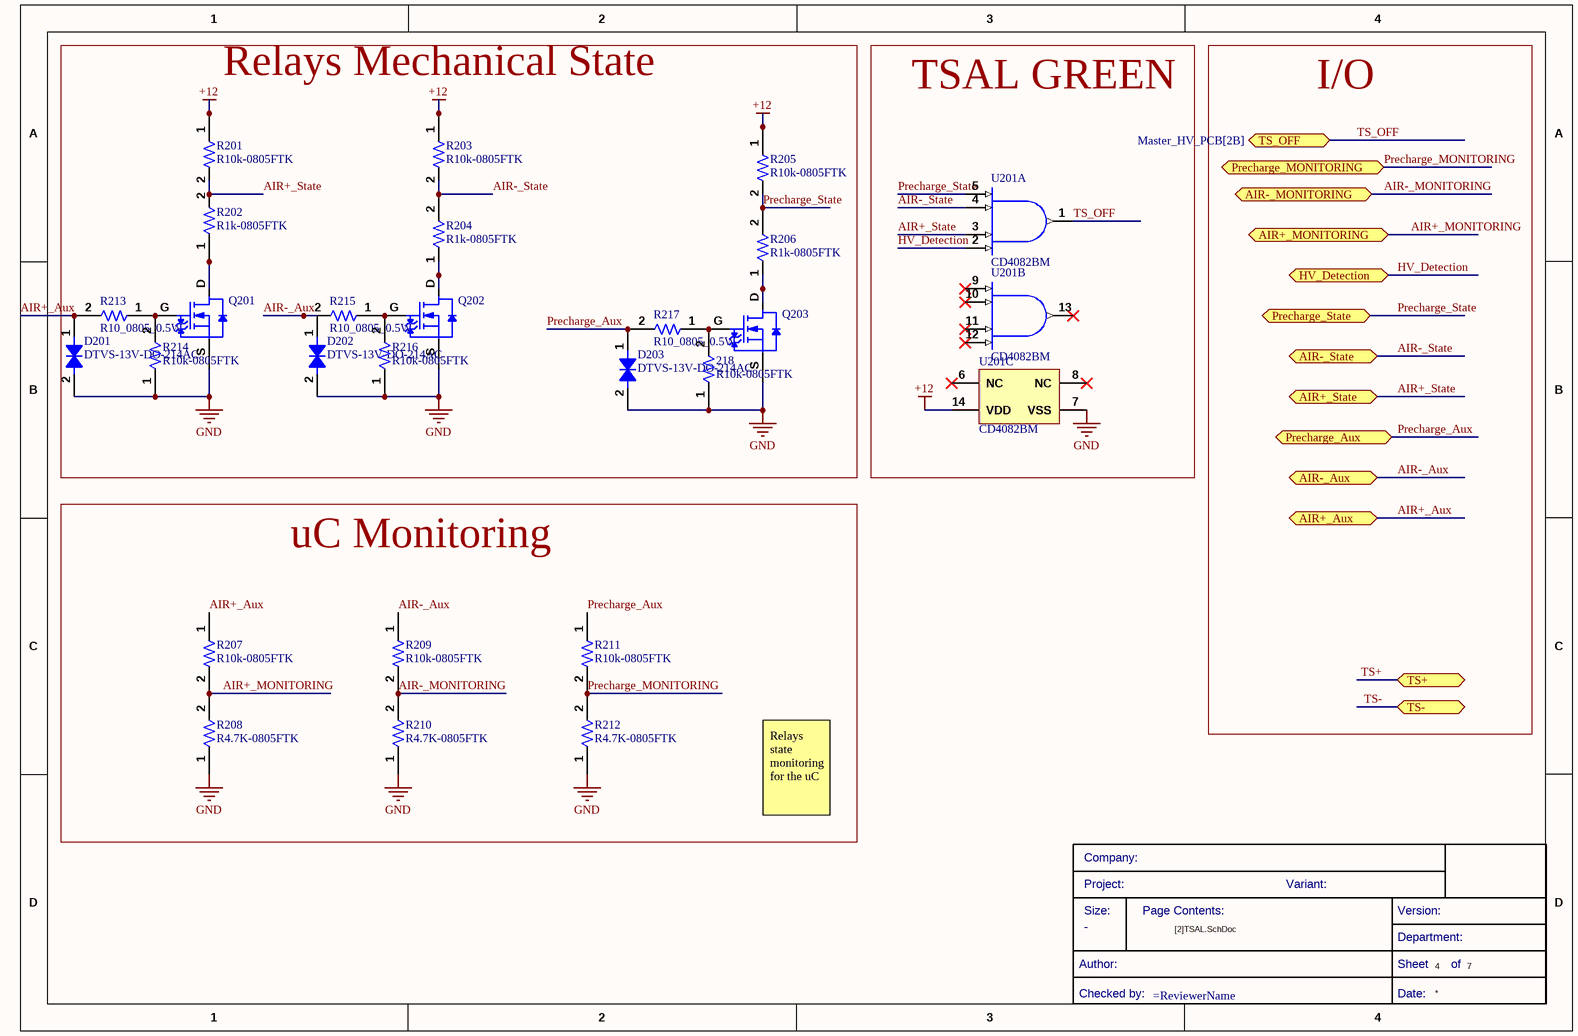
[diagram p4: [2]TSAL.SchDoc]

### Parts
(Parts that share a designator on the sheet are numbered #1, #2 ... from top to bottom, then left to right.)
218  R10k-0805FTK  [R0805FTK]
?#5  (no value)  (graphical)
D201  DTVS-13V-DO-214AC  [DTVS-DO-214AC]
D202  DTVS-13V-DO-214AC  [DTVS-DO-214AC]
D203  DTVS-13V-DO-214AC  [DTVS-DO-214AC]
Q201  SQ2362ES-T1_BE3  [SOT95P245X110-3N]  (value not drawn)
Q202  SQ2362ES-T1_BE3  [SOT95P245X110-3N]  (value not drawn)
Q203  SQ2362ES-T1_BE3  [SOT95P245X110-3N]  (value not drawn)
R201  R10k-0805FTK  [R0805FTK]
R202  R1k-0805FTK  [R0805FTK]
R203  R10k-0805FTK  [R0805FTK]
R204  R1k-0805FTK  [R0805FTK]
R205  R10k-0805FTK  [R0805FTK]
R206  R1k-0805FTK  [R0805FTK]
R207  R10k-0805FTK  [R0805FTK]
R208  R4.7K-0805FTK  [R0805FTK]
R209  R10k-0805FTK  [R0805FTK]
R210  R4.7K-0805FTK  [R0805FTK]
R211  R10k-0805FTK  [R0805FTK]
R212  R4.7K-0805FTK  [R0805FTK]
R213  R10_0805_0.5W  [0805]
R214  R10k-0805FTK  [R0805FTK]
R215  R10_0805_0.5W  [0805]
R216  R10k-0805FTK  [R0805FTK]
R217  R10_0805_0.5W  [0805]
U201  CD4082BM  [D0014A_N]  (parts A,B,C of 3)

### Blocks framed on the sheet
Relays Mechanical State: 218 D201-D203 Q201-Q203 R201-R206 R213-R217
TSAL GREEN: U201
uC Monitoring: R207-R212

### Ports
AIR+_Aux (bidir, see Master_HV_PCB[1B]), AIR+_MONITORING (bidir, see Master_HV_PCB[2B]), AIR+_State (bidir, see Master_HV_PCB[1B]), AIR-_Aux (bidir, see Master_HV_PCB[1B]), AIR-_MONITORING (bidir, see Master_HV_PCB[2B]), AIR-_State (bidir, see Master_HV_PCB[1C]), HV_Detection (bidir, see Master_HV_PCB[1B], [3]HV_Detection[4A]), Precharge_Aux (bidir, see Master_HV_PCB[1B]), Precharge_MONITORING (bidir, see Master_HV_PCB[2B]), Precharge_State (bidir, see Master_HV_PCB[1C]), TS+ (bidir, see Master_HV_PCB[1B], [3]HV_Detection[4B], [6]Accumulator_Indicator[3A]), TS- (bidir, see Master_HV_PCB[1B], [3]HV_Detection[4B], [6]Accumulator_Indicator[3A]), TS_OFF (bidir, see Master_HV_PCB[2B])

### Nets
+12: R201.1 R203.1 R205.1 U201.14(VDD)
GND: 218.1 D201.2 D202.2 D203.2 Q201.S Q202.S Q203.S R208.1 R210.1 R212.1 R214.1 R216.1 U201.7(VSS)
AIR+_Aux: D201.1 R207.1 R213.2 ; port AIR+_Aux
AIR+_MONITORING: R207.2 R208.2 ; port AIR+_MONITORING
AIR+_State: R201.2 R202.2 U201.3(C) ; port AIR+_State
AIR-_Aux: D202.1 R209.1 R215.2 ; port AIR-_Aux
AIR-_MONITORING: R209.2 R210.2 ; port AIR-_MONITORING
AIR-_State: R203.2 R204.2 U201.4(B) ; port AIR-_State
HV_Detection: U201.2(D) ; port HV_Detection
Precharge_Aux: D203.1 R211.1 R217.2 ; port Precharge_Aux
Precharge_MONITORING: R211.2 R212.2 ; port Precharge_MONITORING
Precharge_State: R205.2 R206.2 U201.5(A) ; port Precharge_State
TS_OFF: U201.1(J) ; port TS_OFF
Net218_2: 218.2 Q203.G R217.1
NetQ201_D: Q201.D R202.1
NetQ201_G: Q201.G R213.1 R214.2
NetQ202_D: Q202.D R204.1
NetQ202_G: Q202.G R215.1 R216.2
NetQ203_D: Q203.D R206.1

Not connected (* = marked no-connect by the designer): U201 6(NC)* 8(NC)* 9(E)* 10(F)* 11(G)* 12(H)* 13(K)*

### Notes on the sheet
- I/O
- Relays state monitoring for the uC
- Size:
- Company:
- Project:
- Page Contents:
- Variant:
- Version:
- Checked by:
- Author:
- Sheet
- Date:
- Department:
- of

### Library data of the parts
218 R214 R216 = CMP-00085-4: BOURNS         CR0805-JW-103ELF            Surface Mount Chip Resistor, Thick Film, CR Series, 10 kohm, 125 mW,  5%, 150 V; Voltage Rating: 150V; Voltage Rating (DC): 100V; Max Power Dissipation: 125mW; Temperature Coefficient: 200ppm/°C; Value: 10k; .Creator: DR; Depth: 1.25mm; Package Quantity: 1; ComponentLink6Description: https://datasheet.ciiva.com/16783/70154685-16783482.pdf?src-supplier=Allied+Electronics; Max Operating Temperature: 155°C; ComponentLink8Description: https://datasheet.ciiva.com/6559/chpreztr-6559900.pdf?src-supplier=Digi-Key; ComponentLink3URL: https://datasheet.ciiva.com/22693/1902866-22693254.pdf?src-supplier=Element14; ComponentLink2URL: https://datasheet.ciiva.com/9122/chpreztr-9122374.pdf?src-supplier=Avnet; REACH SVHC: No SVHC; ComponentLink9Description: https://datasheet.ciiva.com/6559/chpreztr-6559901.pdf?src-supplier=Digi-Key; ComponentLink1URL: https://datasheet.ciiva.com/11821/0900766b80fcdb72-11821135.pdf?src-supplier=RSComponents; Manufacturer Part Number 1: CR0805-JW-103ELF; ComponentLink8URL: https://datasheet.ciiva.com/6559/chpreztr-6559900.pdf?src-supplier=Digi-Key; Length: 2mm; ComponentLink10Description: https://datasheet.ciiva.com/7985/1856384-7985869.pdf?src-supplier=Element14; Case/Package: 0805; ComponentLink5Description: https://datasheet.ciiva.com/30065/159chpreztr-30065976.pdf?src-supplier=Onlinecomponents.com; Design Item ID: R10k-0805FTK; ComponentLink1Description: https://datasheet.ciiva.com/11821/0900766b80fcdb72-11821135.pdf?src-supplier=RSComponents; Number of Terminations: 2; Radiation Hardening: No; Resistance Tolerance: 5%; ComponentLink4Description: https://datasheet.ciiva.com/7986/691949-7986187.pdf?src-supplier=Element14; ComponentLink3Description: https://datasheet.ciiva.com/22693/1902866-22693254.pdf?src-supplier=Element14; Packaging: Tape and Reel; ComponentLink6URL: https://datasheet.ciiva.com/16783/70154685-16783482.pdf?src-supplier=Allied+Electronics; Pins: 2; ComponentLink5URL: https://datasheet.ciiva.com/30065/159chpreztr-30065976.pdf?src-supplier=Onlinecomponents.com; Mount: Surface Mount; ComponentLink11URL: https://datasheet.ciiva.com/48692/001055517-da-01-en-smd-wid-cr0805-jw-103elf-10k-ohm-1-8w-48692118.pdf?src-supplier=Conrad; ComponentLink11Description: https://datasheet.ciiva.com/48692/001055517-da-01-en-smd-wid-cr0805-jw-103elf-10k-ohm-1-8w-48692118.pdf?src-supplier=Conrad; Military Standard: Not; Power Rating: 125mW; Thickness: 508um; Source: Passives.SchLib; Min Operating Temperature: -55°C; Manufacturer 1: Bourns; Resistor Type: Thick Film; ComponentLink7URL: https://datasheet.ciiva.com/5548/chpreztr-5548491.pdf?src-supplier=Mouser; ComponentLink2Description: https://datasheet.ciiva.com/9122/chpreztr-9122374.pdf?src-supplier=Avnet; Termination: SMD/SMT; Features: Moisture Resistant; ComponentLink4URL: https://datasheet.ciiva.com/7986/691949-7986187.pdf?src-supplier=Element14; RoHS Compliant: Yes; ComponentLink9URL: https://datasheet.ciiva.com/6559/chpreztr-6559901.pdf?src-supplier=Digi-Key; Technology: THICK FILM; ComponentLink10URL: https://datasheet.ciiva.com/7985/1856384-7985869.pdf?src-supplier=Element14; Height: 0.5mm; Category: Chip SMD Resistors; RoHS: Yes; Series: CR0805; Pricing 1: 1=0,05790, 10=0,01540, 25=0,01340, 100=0,00340 (USD); Stock 1: 57566; ComponentLink7Description: https://datasheet.ciiva.com/5548/chpreztr-5548491.pdf?src-supplier=Mouser; Case Code (Metric): 2012; Contact Plating: Tin; Tolerance: 5%; Construction: Rectangular; Width: 1.25mm
?#5 = CMP-00043-6: Standard Title Block
D201-D203 = CMP-00155-1: Tvs Diode, 400W, 13V, Bidir, DO-214AC; Manufacturer Part Number: 824501131; Manufacturer: Wurth Electronics; Peak Pulse Current: 18.6A; Power Line Protection: No; .Creator: DO; Forward Voltage: 15.15V; Polarity: Bidirectional; Number of Bidirectional Channels: 1; Clamping Voltage: 21.5V; Max Operating Temperature: 150°C; Category: TVS Diodes; Stock 1: 1000; RoHS: Yes; ComponentLink3Description: Where buy it; Source: Filter components.SchLib; Design Item ID: DTVS-13V-DO-214AC; REACH SVHC: Unknown; Min Operating Temperature: -65°C; Resistor Type: Zener; ComponentLink2Description: http://www.farnell.com/datasheets/2036399.pdf?src-supplier=Element14; Peak Pulse Power: 400W; ComponentLink1URL: https://katalog.we-online.de/pbs/datasheet/824501131.pdf?src-supplier=Digi-Key; Packaging: Cut Tape; ComponentLink2URL: http://www.farnell.com/datasheets/2036399.pdf?src-supplier=Element14; ComponentLink3URL: https://www.we-online.com/catalog/en/WE-TVSP?sq=824501131#824501131; RoHS Compliant: Yes; Reverse Standoff Voltage: 13V; Mount: Surface Mount; Min Breakdown Voltage: 15.15V; ComponentLink1Description: https://katalog.we-online.de/pbs/datasheet/824501131.pdf?src-supplier=Digi-Key; Pricing 1: 1=0,27000 (USD); Pins: 2
Q201-Q203 = CMP-013-00001-1: Small Signal Field-Effect Transistor; RoHS Compliant: Yes
R201 R203 R205 R207 R209 R211 = CMP-00085-1: BOURNS         CR0805-JW-103ELF            Surface Mount Chip Resistor, Thick Film, CR Series, 10 kohm, 125 mW,  5%, 150 V; .Creator: DR; Power Rating: 125mW; Voltage Rating (DC): 100V; Voltage Rating: 150V; Temperature Coefficient: 200ppm/°C; Value: 10k; ComponentLink6URL: https://datasheet.ciiva.com/16783/70154685-16783482.pdf?src-supplier=Allied+Electronics; Manufacturer 1: Bourns; Package Quantity: 1; ComponentLink10URL: https://datasheet.ciiva.com/7985/1856384-7985869.pdf?src-supplier=Element14; Technology: THICK FILM; Source: Passives.SchLib; RoHS Compliant: Yes; ComponentLink10Description: https://datasheet.ciiva.com/7985/1856384-7985869.pdf?src-supplier=Element14; ComponentLink1URL: https://datasheet.ciiva.com/11821/0900766b80fcdb72-11821135.pdf?src-supplier=RSComponents; ComponentLink7Description: https://datasheet.ciiva.com/5548/chpreztr-5548491.pdf?src-supplier=Mouser; Radiation Hardening: No; Design Item ID: R10k-0805FTK; ComponentLink4Description: https://datasheet.ciiva.com/7986/691949-7986187.pdf?src-supplier=Element14; Pins: 2; ComponentLink9URL: https://datasheet.ciiva.com/6559/chpreztr-6559901.pdf?src-supplier=Digi-Key; Resistor Type: Thick Film; ComponentLink4URL: https://datasheet.ciiva.com/7986/691949-7986187.pdf?src-supplier=Element14; Contact Plating: Tin; Case Code (Metric): 2012; Military Standard: Not; Depth: 1.25mm; Case/Package: 0805; Packaging: Tape and Reel; ComponentLink9Description: https://datasheet.ciiva.com/6559/chpreztr-6559901.pdf?src-supplier=Digi-Key; Construction: Rectangular; Pricing 1: 1=0,05790, 10=0,01540, 25=0,01340, 100=0,00340 (USD); ComponentLink7URL: https://datasheet.ciiva.com/5548/chpreztr-5548491.pdf?src-supplier=Mouser; Category: Chip SMD Resistors; Length: 2mm; Max Operating Temperature: 155°C; Resistance Tolerance: 5%; Manufacturer Part Number 1: CR0805-JW-103ELF; Height: 0.5mm; ComponentLink2URL: https://datasheet.ciiva.com/9122/chpreztr-9122374.pdf?src-supplier=Avnet; Thickness: 508um; Max Power Dissipation: 125mW; ComponentLink8Description: https://datasheet.ciiva.com/6559/chpreztr-6559900.pdf?src-supplier=Digi-Key; REACH SVHC: No SVHC; ComponentLink8URL: https://datasheet.ciiva.com/6559/chpreztr-6559900.pdf?src-supplier=Digi-Key; ComponentLink5URL: https://datasheet.ciiva.com/30065/159chpreztr-30065976.pdf?src-supplier=Onlinecomponents.com; Width: 1.25mm; ComponentLink11URL: https://datasheet.ciiva.com/48692/001055517-da-01-en-smd-wid-cr0805-jw-103elf-10k-ohm-1-8w-48692118.pdf?src-supplier=Conrad; ComponentLink3Description: https://datasheet.ciiva.com/22693/1902866-22693254.pdf?src-supplier=Element14; ComponentLink11Description: https://datasheet.ciiva.com/48692/001055517-da-01-en-smd-wid-cr0805-jw-103elf-10k-ohm-1-8w-48692118.pdf?src-supplier=Conrad; ComponentLink1Description: https://datasheet.ciiva.com/11821/0900766b80fcdb72-11821135.pdf?src-supplier=RSComponents; ComponentLink2Description: https://datasheet.ciiva.com/9122/chpreztr-9122374.pdf?src-supplier=Avnet; Stock 1: 57566; Min Operating Temperature: -55°C; Series: CR0805; Number of Terminations: 2; Termination: SMD/SMT; Tolerance: 5%; Mount: Surface Mount; ComponentLink6Description: https://datasheet.ciiva.com/16783/70154685-16783482.pdf?src-supplier=Allied+Electronics; ComponentLink5Description: https://datasheet.ciiva.com/30065/159chpreztr-30065976.pdf?src-supplier=Onlinecomponents.com; RoHS: Yes; Features: Moisture Resistant; ComponentLink3URL: https://datasheet.ciiva.com/22693/1902866-22693254.pdf?src-supplier=Element14
R202 R204 R206 = CMP-00076-1: Res Thick Film 0805 1K Ohm 5% 1/8W ±200ppm/°C Molded SMD SMD Paper Tape on Plastic Reel; Manufacturer Part Number 1: CR0805-JW-102ELF; Manufacturer 1: Bourns; Voltage Rating (DC): 150V; Power Rating: 125mW; .Creator: GP; Number of Terminations: 2; REACH SVHC: No SVHC; ComponentLink3URL: https://datasheet.ciiva.com/22693/1902866-22693253.pdf?src-supplier=Element14; ComponentLink1URL: https://datasheet.ciiva.com/11821/0900766b80fcdb72-11821134.pdf?src-supplier=RSComponents; ComponentLink1Description: https://datasheet.ciiva.com/11821/0900766b80fcdb72-11821134.pdf?src-supplier=RSComponents; Category: Chip SMD Resistors; Stock 1: 27510; Case/Package: 0805; ComponentLink3Description: https://datasheet.ciiva.com/22693/1902866-22693253.pdf?src-supplier=Element14; Length: 2mm; ComponentLink5URL: https://datasheet.ciiva.com/7985/1856384-7985867.pdf?src-supplier=Element14; ComponentLink7Description: https://datasheet.ciiva.com/6547/chpreztr-6547359.pdf?src-supplier=Digi-Key; Package Quantity: 1; Tolerance: 5%; Lead Free: Lead Free; RoHS: Yes; Contact Plating: Tin; ComponentLink2Description: https://datasheet.ciiva.com/15225/getdatasheetpartid-78155-15225381.pdf?src-supplier=Verical; ComponentLink5Description: https://datasheet.ciiva.com/7985/1856384-7985867.pdf?src-supplier=Element14; Depth: 1.25mm; Thickness: 508um; Resistor Type: Thick Film; Design Item ID: R1k-0805FTK; ComponentLink2URL: https://datasheet.ciiva.com/15225/getdatasheetpartid-78155-15225381.pdf?src-supplier=Verical; Max Operating Temperature: 155°C; ComponentLink6URL: https://datasheet.ciiva.com/30242/159chpreztr-30242765.pdf?src-supplier=Onlinecomponents.com; ComponentLink4URL: https://datasheet.ciiva.com/7986/1856384-7986184.pdf?src-supplier=Element14; Military Standard: Not; Case Code (Metric): 2012; Temperature Coefficient: 200ppm/°C; Pricing 1: 1=0,05930, 10=0,03510, 25=0,01790, 100=0,00800, 250=0,00790, 500=0,00590, 1000=0,00360, 3000=0,00350, 6000=0,00250 (USD); Min Operating Temperature: -55°C; ComponentLink7URL: https://datasheet.ciiva.com/6547/chpreztr-6547359.pdf?src-supplier=Digi-Key; Width: 1.25mm; Source: Passives.SchLib; Max Power Dissipation: 125mW; Voltage Rating: 150V; ComponentLink4Description: https://datasheet.ciiva.com/7986/1856384-7986184.pdf?src-supplier=Element14; Features: Moisture Resistant; Mount: Surface Mount; Termination: SMD/SMT; Value: 1k; Height: 0.5mm; Radiation Hardening: No; ComponentLink6Description: https://datasheet.ciiva.com/30242/159chpreztr-30242765.pdf?src-supplier=Onlinecomponents.com; Pins: 2; Packaging: Tape and Reel
R208 R210 R212 = CMP-00102-1: as R107 on sheet [1]Shutdown; ComponentLink5URL: https://datasheet.ciiva.com/9122/chpreztr-9122814.pdf?src-supplier=Avnet; ComponentLink2URL: https://datasheet.ciiva.com/6560/chpreztr-6560073.pdf?src-supplier=Digi-Key; Depth: 1.25mm; ComponentLink7URL: https://datasheet.ciiva.com/6560/chpreztr-6560075.pdf?src-supplier=Digi-Key; Radiation Hardening: No; ComponentLink5Description: https://datasheet.ciiva.com/9122/chpreztr-9122814.pdf?src-supplier=Avnet; Construction: Rectangular; Case/Package: 0805; Design Item ID: R4.7K-0805FTK; RoHS Compliant: Yes; Min Operating Temperature: -55°C; Height: 0.024inch; ComponentLink1Description: https://datasheet.ciiva.com/5541/chpreztr-5541593.pdf?src-supplier=Mouser; Series: CR0805; Packaging: Tape and Reel; Width: 0.049inch; Stock 1: 3734; ComponentLink3URL: https://datasheet.ciiva.com/6560/chpreztr-6560074.pdf?src-supplier=Digi-Key; ComponentLink4URL: https://datasheet.ciiva.com/30174/159chpreztr-30174252.pdf?src-supplier=Onlinecomponents.com; Value: 4.7k; Military Standard: Not; Tolerance: 5%; Voltage Rating: 150V; ComponentLink6Description: https://datasheet.ciiva.com/22713/691949-22713272.pdf?src-supplier=Element14; REACH SVHC: No SVHC; Package Quantity: 1; Termination: SMD/SMT; ComponentLink1URL: https://datasheet.ciiva.com/5541/chpreztr-5541593.pdf?src-supplier=Mouser; ComponentLink4Description: https://datasheet.ciiva.com/30174/159chpreztr-30174252.pdf?src-supplier=Onlinecomponents.com; Resistor Type: Thick Film; Length: 2mm; Case Code (Metric): 2012; Category: Chip SMD Resistors; Resistance Tolerance: 5%; Thickness: 508um; ComponentLink6URL: https://datasheet.ciiva.com/22713/691949-22713272.pdf?src-supplier=Element14; Features: Moisture Resistant; Power Rating: 125mW; RoHS: Yes; Mount: Surface Mount; ComponentLink7Description: https://datasheet.ciiva.com/6560/chpreztr-6560075.pdf?src-supplier=Digi-Key; Number of Terminations: 2; Source: Passives.SchLib; Temperature Coefficient: 200ppm/°C; Max Operating Temperature: 155°C; ComponentLink3Description: https://datasheet.ciiva.com/6560/chpreztr-6560074.pdf?src-supplier=Digi-Key; ComponentLink2Description: https://datasheet.ciiva.com/6560/chpreztr-6560073.pdf?src-supplier=Digi-Key; Pricing 1: 1=0,05590, 10=0,01670, 25=0,01290, 100=0,00840, 250=0,00830, 500=0,00690, 1000=0,00410 (USD); Contact Plating: Tin
R213 R215 R217 = CMP-009-00031-1: as R401 on sheet [4]Relays_Control; Tolerance: 1%; Max Operating Temperature: 155°C; RoHS Compliant: Yes; Case/Package: 0805; Min Operating Temperature: -55°C; Mounting Technology: Surface Mount; Pins: 2
U201 = CMP-00218-1: AND Gate, 4000/14000/40000 Series, 2-Func, 4-Input, CMOS, PDSO14; Min Supply Voltage: 3V; Schmitt Trigger: No; Package Equivalence Code: SOP14,.25; Power Supplies: 5/15V; Channels: 2; Propagation Delay (tpd): 250ns; Max Supply Voltage: 18V; Nominal Supply Voltage: 5V; Number of Inputs: 4; Load Capacitance (CL): 50pF; Package Body Material: Plastic; Qualification Status: Not Qualified; Load/Preset Input: Yes; Moisture Sensitivity Level: 1; Terminal Position: DUAL; Logic Type: AND GATE; Terminal Pitch: 1.27mm; Width: 3.9mm; Length: 8.65mm; Min Operating Temperature: -55°C; Height - Seated (Max): 1.75mm; Reach SVHC Compliant: Yes; JESD-30 Code: R-PDSO-G14; RoHS Compliant: Yes; Package Shape: Rectangular; JESD-609 Code: e4; Prop. Delay@Nom-Sup: 250ns; Packaging: Rail/Tube; Peak Reflow Temperature (Cel): 260°C; Terminal Finish: Nickel; Case/Package: SOP; Technology: CMOS; Terminal Form: Gull Wing; Surface Mount: Yes; Temperature Grade: MILITARY; Package Style: SMALL OUTLINEMeter; Pins: 14; Max Operating Temperature: 125°C